# EAGLE design adapter (EAGLE 6.5.0)

## Sheet 1 of 3
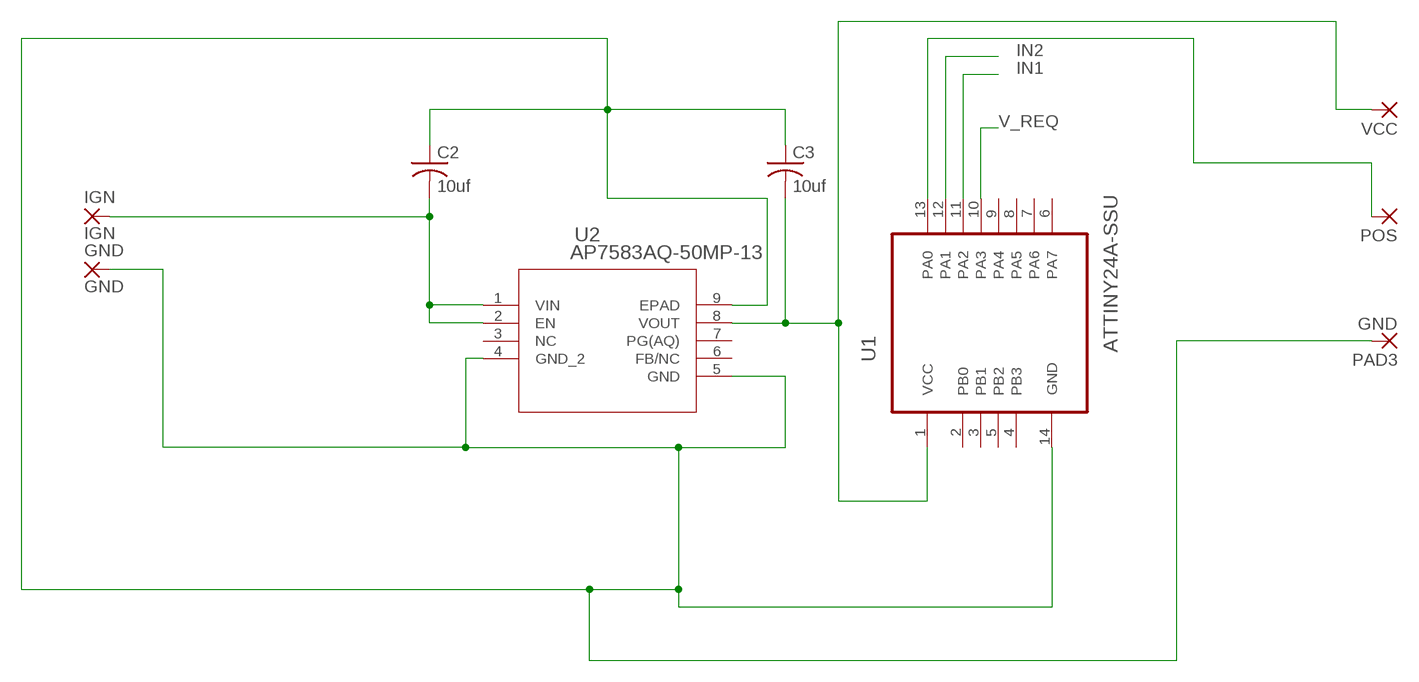
[diagram p0: schematic, sheet 1]

### Parts
C2  10uf  C-USC1206  [C1206]
C3  10uf  C-USC1206  [C1206]
GND  GND  2,15/1,0  [2,15/1,0]
IGN  IGN  2,15/1,0  [2,15/1,0]
PAD3  GND  2,15/1,0  [2,15/1,0]
POS  2,15/1,0  [2,15/1,0]
U1  ATTINY24A-SSU  [SOIC127P600X175-14N]
U2  AP7583AQ-50MP-13  [MSOP-8EP_DIO]
VCC  2,15/1,0  [2,15/1,0]

### Nets
GND: C2.1 C3.1 GND.1(P) PAD3.1(P) U1.14(GND) U2.4(GND_2) U2.5(GND) U2.9(EPAD) ; also sheet 2,3
IGN: C2.2 IGN.1(P) U2.1(VIN) U2.2(EN) ; also sheet 2
IN1: U1.11(PA2) ; also sheet 2
IN2: U1.12(PA1) ; also sheet 2
N$4: POS.1(P) U1.13(PA0)
V_REQ: U1.10(PA3) ; also sheet 3
VCC: C3.2 U1.1(VCC) U2.8(VOUT) VCC.1(P) ; also sheet 3
Unconnected: U1.2(PB0) U1.3(PB1) U1.4(PB3) U1.5(PB2) U1.6(PA7) U1.7(PA6) U1.8(PA5) U1.9(PA4) U2.3(NC) U2.6(FB/NC) U2.7(PG(AQ))

## Sheet 2 of 3
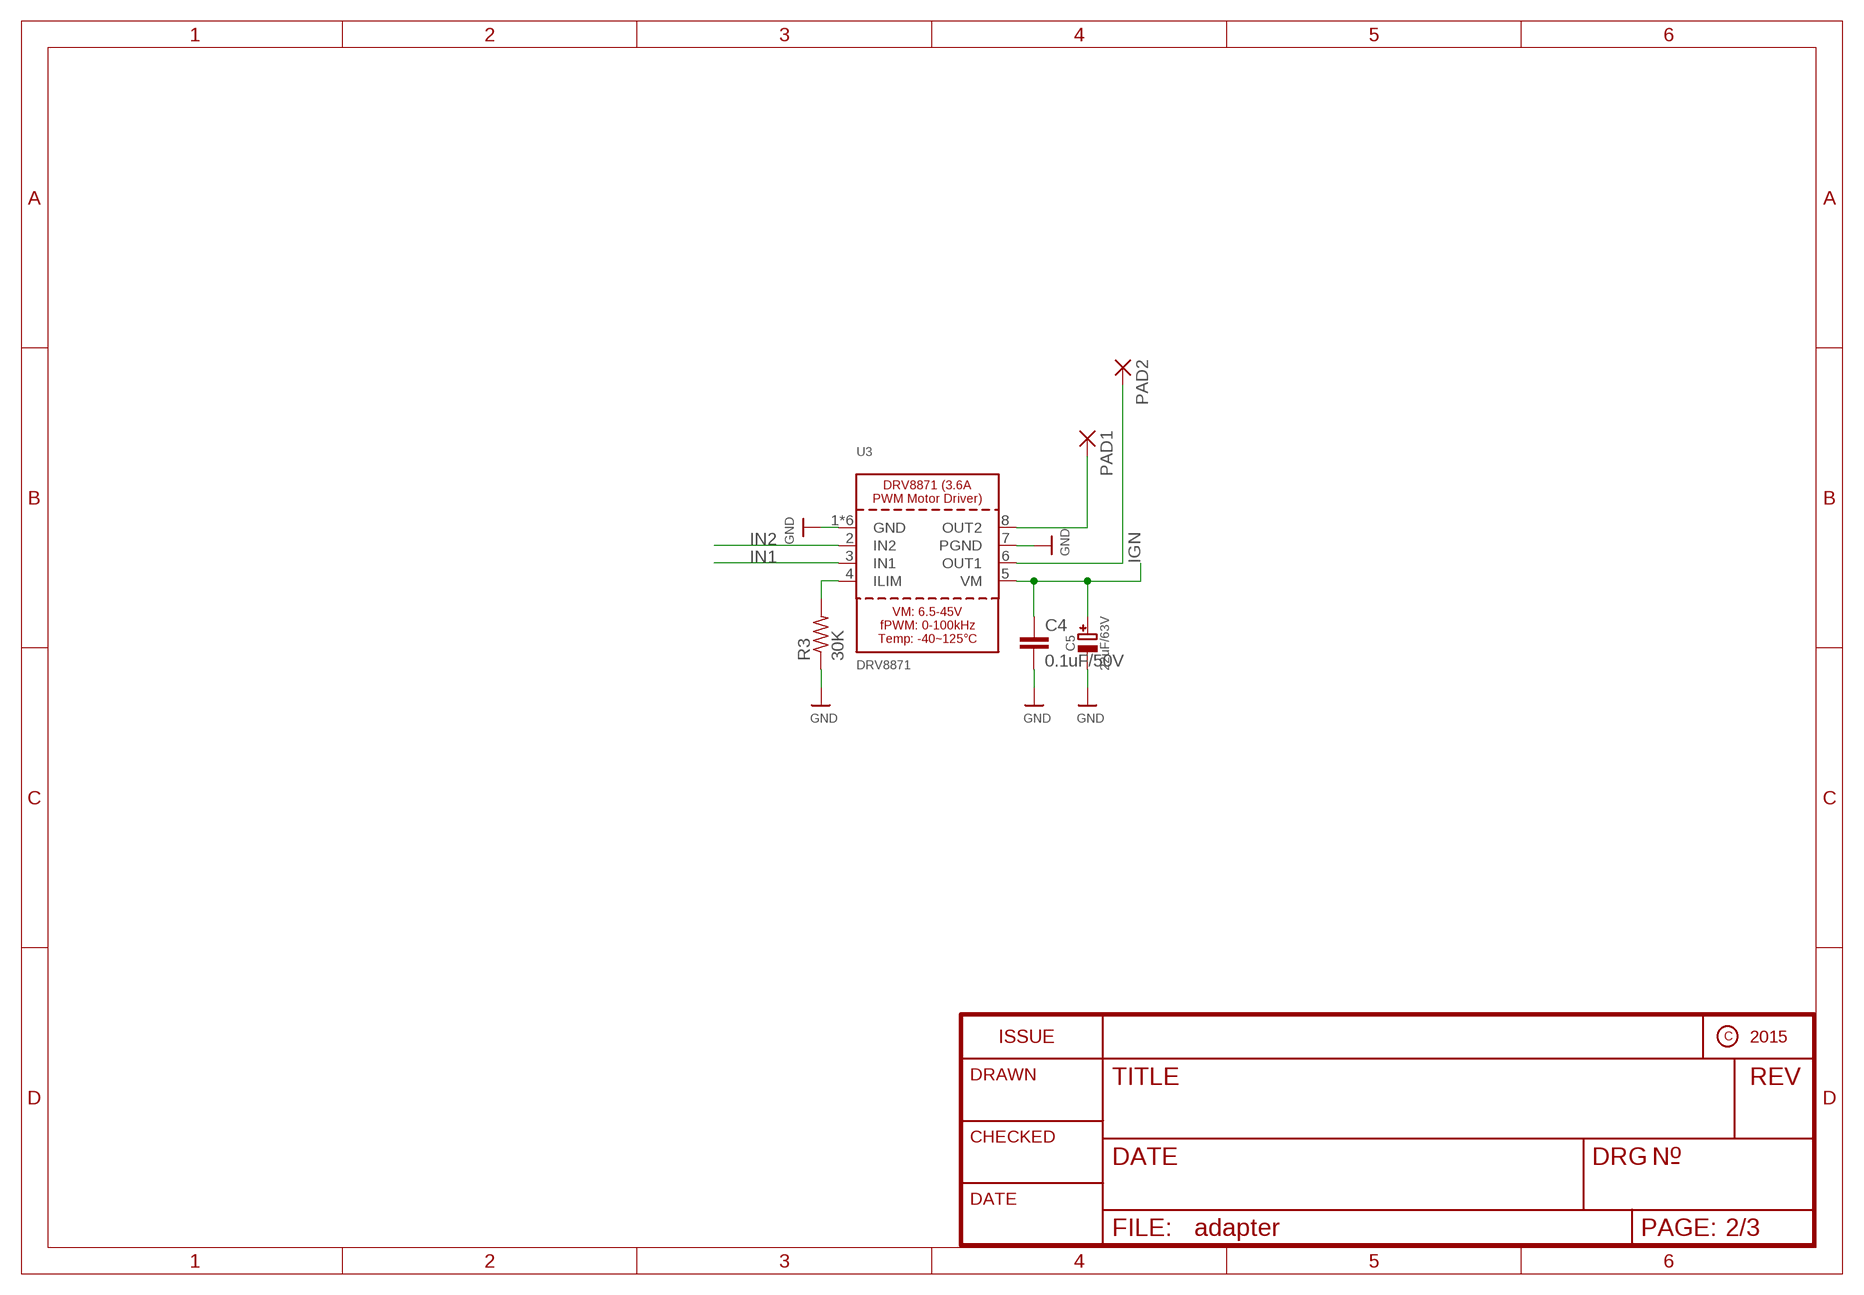
[diagram p1: schematic, sheet 2]

### Parts
C4  0.1uF/50V  C-EUC1206  [C1206]
C5  22uF/63V  CAP_ELECTROLYTICPANASONIC_D  [PANASONIC_D]
PAD1  2,15/1,0  [2,15/1,0]
PAD2  2,15/1,0  [2,15/1,0]
R3  30K  R-US_M1206  [M1206]
U3  DRV8871  [HSOP8]

### Nets
GND: C4.2 C5.- R3.1 U3.1(GND) U3.7(PGND) U3.GND U3.P$1(GND) U3.P$2(GND) U3.P$3(GND) U3.P$4(GND) ; also sheet 1,3
IGN: C4.1 C5.+ U3.5(VM) ; also sheet 1
IN1: U3.3(IN1) ; also sheet 1
IN2: U3.2(IN2) ; also sheet 1
N$10: R3.2 U3.4(ILIM)
OUT1: PAD2.1(P) U3.6(OUT1)
OUT2: PAD1.1(P) U3.8(OUT2)

## Sheet 3 of 3
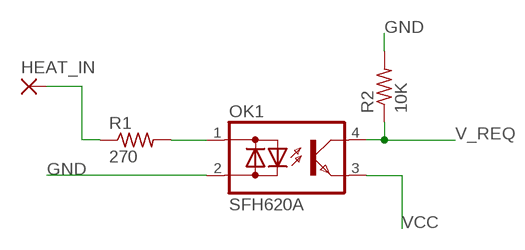
[diagram p2: schematic, sheet 3]

### Parts
HEAT_IN  2,15/1,0  [2,15/1,0]
OK1  SFH620A  [DIL04]
R1  270  R-US_R2010  [R2010]
R2  10K  R-US_M1206  [M1206]

### Nets
GND: OK1.2(AC2) R2.2 ; also sheet 1,2
N$1: OK1.1(AC1) R1.2
N$2: HEAT_IN.1(P) R1.1
V_REQ: OK1.4(C) R2.1 ; also sheet 1
VCC: OK1.3(E) ; also sheet 1

## Library data of the parts
C2 C3 = adafruit:C-US: CAPACITOR, American symbol
C4 = resistor:C-EU: CAPACITOR, European symbol
C5 = microbuilder:CAP_ELECTROLYTIC: Electrolytic Capacitors SMT PANASONIC_C - Size C Panasonic Electrolytic Aluminum Capacitor 47µF 16V 20% Electrolytic Capacitor [Digikey: PCE3890TR-ND] PANASONIC_D - Size D Panasonic Electrolytic Aluminum Capacitor 100µF 25V 20% Electrolytic Capacitor [Digikey: PCE3898TR-ND] PTH 3.5 mm grid, 8 mm diameter ... 3.5 mm grid, 10 mm diameter ...
GND HEAT_IN IGN PAD1-PAD3 POS VCC = wirepad:2,15/1,0: THROUGH-HOLE PAD
OK1 = optocoupler:SFH620: Optocoupler, Phototransistor Output, AC Input Source: http://www.vishay.com/docs/83675/sfh620.pdf; MPN: SFH620A-2; OC_FARNELL: 1469594; OC_NEWARK: 97K9546
R1-R3 = resistor:R-US_: RESISTOR, American symbol
U1 = Atmel_By_element14_Batch_1-00:ATTINY24A-SSU: 8-bit Microcontroller with In-System Programmable Flash; MPN: ATTINY24A-SSU; OC_FARNELL: 1699395; OC_NEWARK: 80P3681; PACKAGE: SOIC-14; SUPPLIER: Atmel
U2 = AP7583AQ-50MP-13:AP7583AQ-50MP-13; COPYRIGHT: Copyright (C) 2024 Ultra Librarian. All rights reserved.; MANUFACTURER_PART_NUMBER: AP7583AQ-50MP-13; MFR_NAME: Diodes Inc; TYPE: Power Management
U3 = microbuilder:DRV8871: DRV8871 - 3.6A PWM Motor Driver

## Board
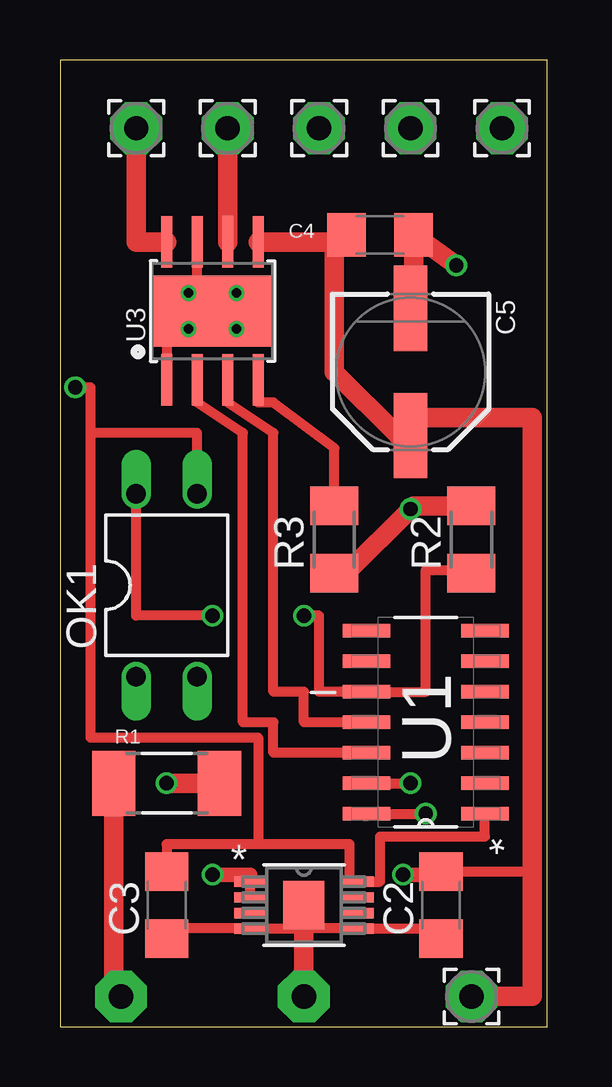
[diagram p3: board, top side]
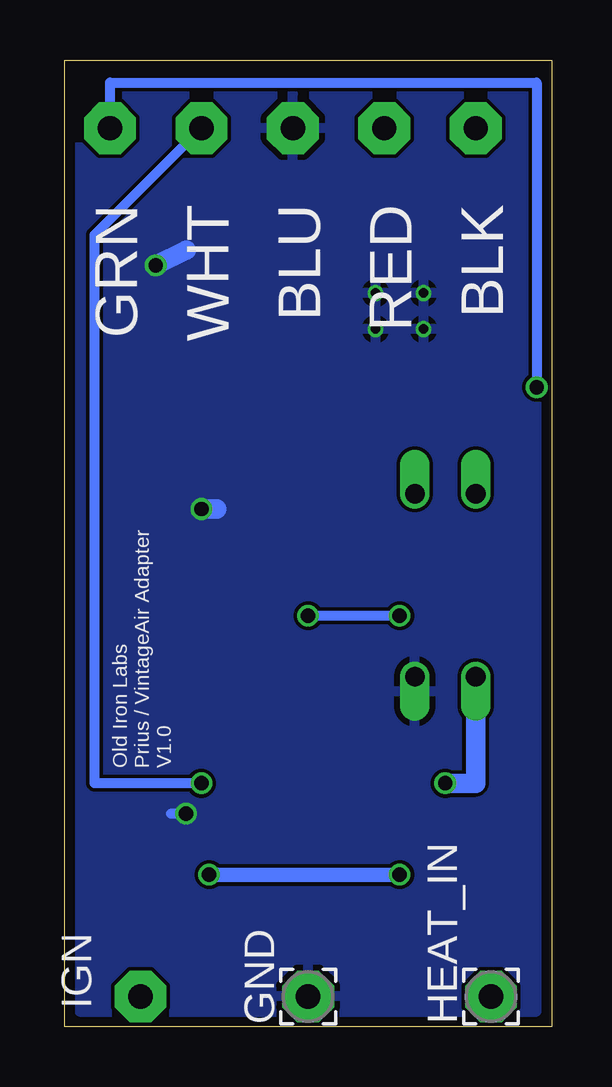
[diagram p4: board, bottom side, seen from below]

Size 20.3 x 40.31 mm. Coordinates in mm from the lower left corner, seen from the top.
Outline: 0,0 20.3,0 20.3,40.31 0,40.31 0,0
Copper layers (1*16): Top 0.035559375mm / dielectric 1.6mm / Bottom 0.035559375mm
Design rules "oshpark-2layer": minimum track width 6mil, minimum drill 10mil, track to track 6mil, track to pad 6mil, pad to pad 6mil, via to via 6mil, smd to smd 6mil, copper to edge 15mil, drill to drill 6mil, minimum pad ring 5mil, minimum via ring 5mil, stop-mask expansion 2.5mil, vias tented up to drill 0mil, thermal gap 10mil

### Footprints (pad centres in the part's own frame; a part is rotated, then mirrored left to right if it is on the bottom)
C1206 = smd 1.6 x 1.8: 1 -1.4,0; 2 1.4,0
PANASONIC_D = smd 3.556 x 1.4: + 2.654,0; - -2.654,0
2,15/1,0 = drill 1.016 pad 2.159 octagon: 1 0,0
DIL04 = drill 0.813 offset: 1 -1.27,-3.81; 2 1.27,-3.81; 3 1.27,3.81; 4 -1.27,3.81
R2010 = smd 1.8 x 2.7: 1 -2.2,0; 2 2.2,0
M1206 = smd 1.6 x 2: 1 -1.4,0; 2 1.4,0
SOIC127P600X175-14N = smd 1.981 x 0.559: 1 -2.464,3.81; 2 -2.464,2.54; 3 -2.464,1.27; 4 -2.464,0; 5 -2.464,-1.27; 6 -2.464,-2.54; 7 -2.464,-3.81; 8 2.464,-3.81; 9 2.464,-2.54; 10 2.464,-1.27; 11 2.464,0; 12 2.464,1.27; 13 2.464,2.54; 14 2.464,3.81
MSOP-8EP_DIO = smd 1.359 x 0.432: 1 -2.229,0.975; 2 -2.229,0.325; 3 -2.229,-0.325; 4 -2.229,-0.975; 5 2.229,-0.975; 6 2.229,-0.325; 7 2.229,0.325; 8 2.229,0.975 | smd 1.702 x 2.007: 9 0,0
HSOP8 = smd 0.45 x 2.15: 1 -1.905,-2.875; 2 -0.635,-2.875; 3 0.635,-2.875; 4 1.905,-2.875; 5 1.905,2.875; 6 0.635,2.875; 7 -0.635,2.875; 8 -1.905,2.875 | smd 4.9 x 2.95: GND 0,0 | drill 0.4: P$1 -1,0.75; P$2 -1,-0.75; P$3 1,-0.75; P$4 1,0.75

### Placement (x,y rotation side)
C2  15.88,5.08 90 top
C3  4.45,5.08 90 top
C4  13.34,33.02 0 top
C5  14.61,27.3 270 top
GND  10.16,1.27 90 bottom
HEAT_IN  2.54,1.27 90 bottom
IGN  17.14,1.27 270 top
OK1  4.45,18.41 0 top
PAD1  3.17,37.47 0 top
PAD2  6.99,37.47 0 top
PAD3  10.79,37.47 0 top
POS  14.61,37.47 0 top
R1  4.45,10.16 0 top
R2  17.14,20.32 90 top
R3  11.43,20.32 90 top
U1  15.24,12.7 180 top
U2  10.16,5.08 0 top
U3  6.35,29.84 0 top
VCC  18.41,37.47 0 top

### Tracks (layer width: path | path; a pad name or v marks a point on that pad's centre or on a via)
GND  (via drill 0.6)
  Top 0.406: 10.16,4.45 U2.9 | 10.16,4.45 10.5,4.11 U2.5 15.88,4.11 C2.1 | 10.16,4.45 9.82,4.11 U2.4 4.45,4.11 C3.1 | 12.7,8.89 v15.24,8.89 | U3.P$1 5.71,30.59 U3.7 | U3.P$2 4.45,29.09 U3.1 | U3.P$3 6.35,29.09 U3.GND
  Top 0.61: 12.7,8.89 U1.14
  Top 0.813: GND.1 U2.9 | C5.- 14.73,29.96 C4.2 v16.51,31.75 | R2.2 14.73,21.72 v14.61,21.59 11.94,18.92 R3.1
  Bottom 0.406: v15.24,8.89 15.88,8.89
  Bottom 0.813: v14.61,21.59 13.97,21.59 | v16.51,31.75 15.24,32.38
  pour Bottom: 19.68,0.64 0.64,0.64 0.64,39.37 19.68,39.37
IGN  (via drill 0.6)
  Top 0.406: U2.2 U2.1 | C2.2 19.68,6.48 19.68,6.35
  Top 0.61: C2.2 15.88,6.35 v14.29,6.35 | v6.35,6.35 7.93,6.35 U2.1
  Top 0.813: IGN.1 19.68,1.27 19.68,6.35 19.68,25.4 14.61,25.4 C5.+ 14.08,24.65 11.43,27.3 11.43,32.52 C4.1 11.63,32.72 U3.5
  Bottom 0.61: v14.29,6.35 v6.35,6.35
IN1
  Top 0.406: U1.11 10.16,12.7 10.16,13.97 8.89,13.97 8.89,24.77 6.99,26.04 U3.3
IN2
  Top 0.406: U1.12 8.89,11.43 8.89,12.7 7.62,12.7 7.62,24.77 5.71,26.04 U3.2
N$1  (via drill 0.6)
  Top 0.813: R1.2 v4.45,10.16
  Bottom 0.813: v4.45,10.16 3.17,10.16 OK1.1
N$2
  Top 0.813: HEAT_IN.1 arc-90 2.25,1.56 R1.1
N$4  (via drill 0.6)
  Top 0.406: U1.13 v14.61,10.16
  Bottom 0.406: v14.61,10.16 19.05,10.16 19.05,33.02 POS.1
N$10
  Top 0.406: R3.2 11.43,24.13 8.89,26.04 8.26,26.04 U3.4
OUT1
  Top 0.813: U3.6 PAD2.1
OUT2
  Top 0.813: U3.8 3.17,32.72 PAD1.1
V_REQ  (via drill 0.6)
  Top 0.406: R2.1 17.14,19.05 15.24,19.05 15.24,13.97 U1.10 10.79,13.97 10.79,17.14 v10.16,17.14 | v6.35,17.14 3.17,17.14 OK1.4
  Bottom 0.406: v10.16,17.14 v6.35,17.14
VCC  (via drill 0.6)
  Top 0.406: 17.78,8.81 U1.1 17.7,7.94 13.34,7.94 13.34,6.05 U2.8 12.06,6.05 12.06,7.62 8.26,7.62 | 8.26,7.62 4.45,7.62 C3.2 | OK1.3 5.71,24.77 1.27,24.77 | 1.27,24.77 1.27,12.06 8.26,12.06 8.26,7.62 | v0.64,26.67 1.27,26.67 1.27,24.77
  Bottom 0.406: v0.64,26.67 0.64,39.37 18.41,39.37 VCC.1

### Text on the board
bNames: BLK | RED | BLU | WHT | GRN | Old Iron Labs / Prius / VintageAir Adapter / V1.0